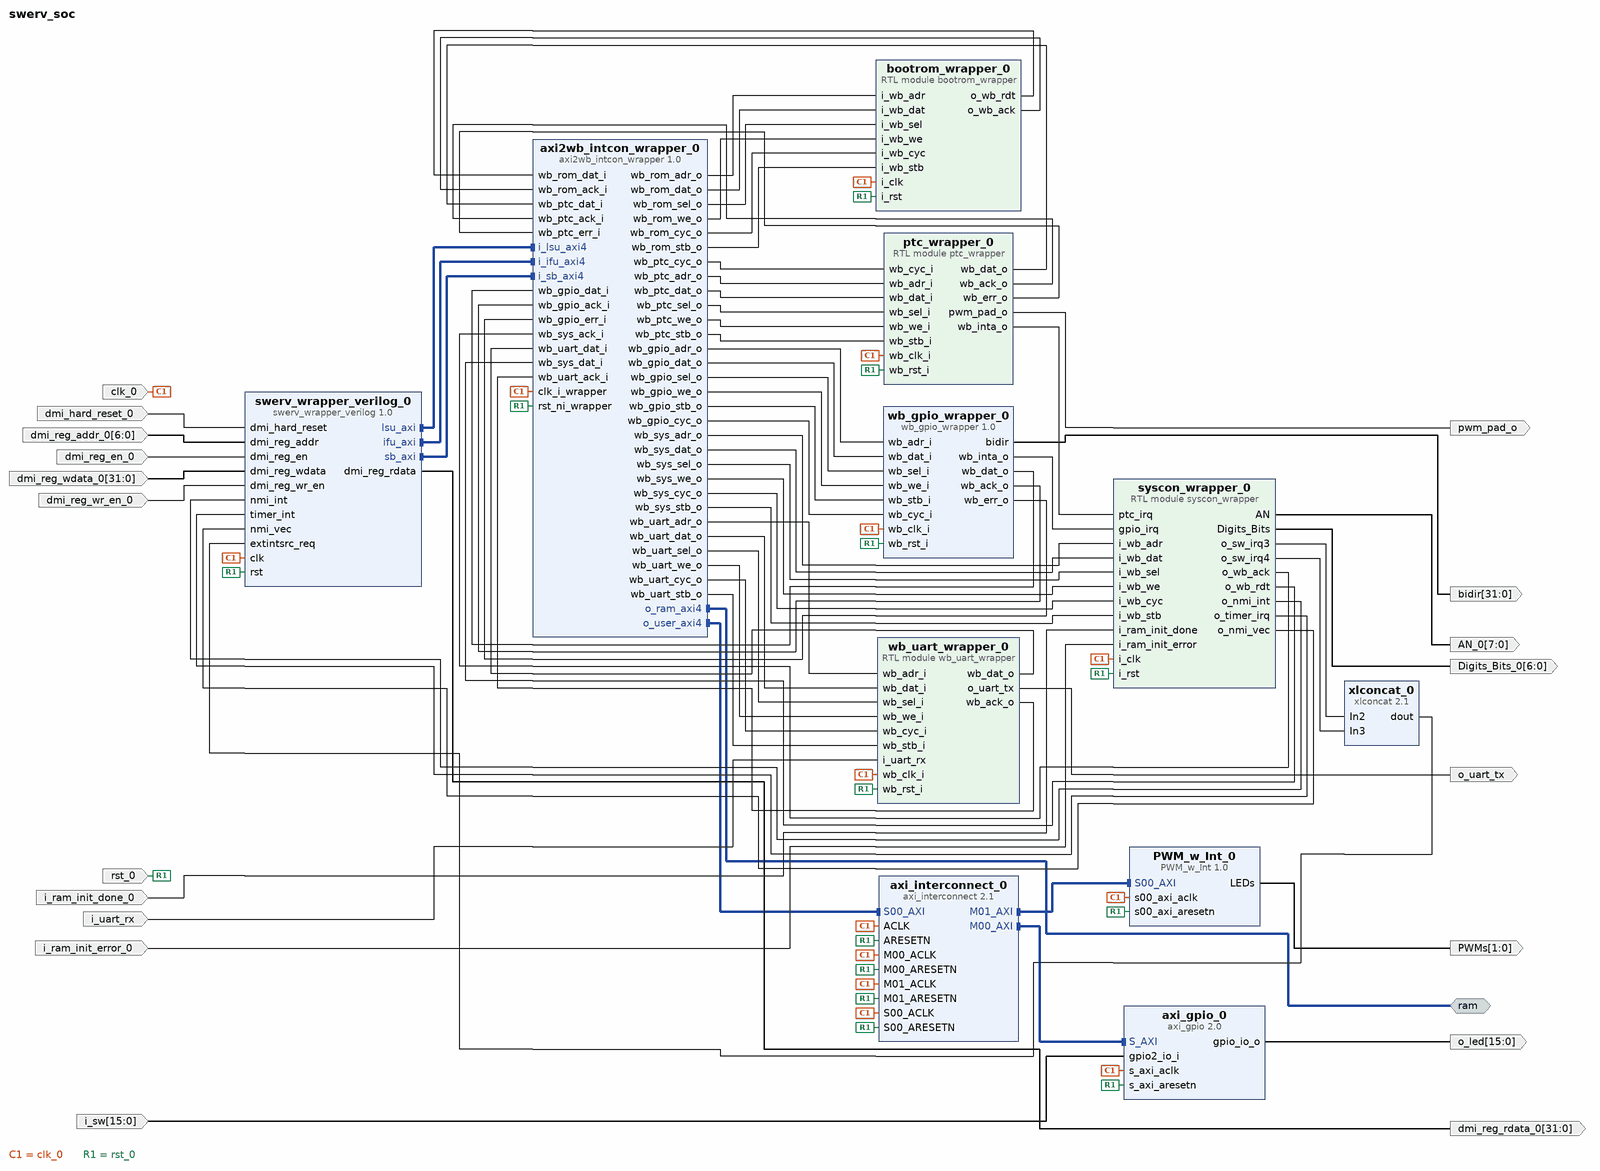
[diagram p0: block diagram of the top level]
# Vivado block design swerv_soc, xc7a100tcsg324-1, Vivado 2019.2
create_bd_design swerv_soc

create_bd_intf_port -mode Master -vlnv xilinx.com:interface:aximm_rtl:1.0 ram
set_property -dict {CONFIG.DATA_WIDTH 64 CONFIG.PROTOCOL AXI4 CONFIG.ADDR_WIDTH 32} [get_bd_intf_ports ram]
create_bd_port -dir I -type clk clk_0
create_bd_port -dir I -type rst dmi_hard_reset_0
create_bd_port -dir I -from 6 -to 0 dmi_reg_addr_0
create_bd_port -dir I dmi_reg_en_0
create_bd_port -dir O -from 31 -to 0 dmi_reg_rdata_0
create_bd_port -dir I -from 31 -to 0 dmi_reg_wdata_0
create_bd_port -dir I dmi_reg_wr_en_0
create_bd_port -dir I -type rst rst_0
create_bd_port -dir O -from 7 -to 0 AN_0
create_bd_port -dir O -from 6 -to 0 Digits_Bits_0
create_bd_port -dir I i_ram_init_done_0
create_bd_port -dir I i_ram_init_error_0
create_bd_port -dir O -from 31 -to 0 bidir
create_bd_port -dir O -from 15 -to 0 o_led
create_bd_port -dir I -from 15 -to 0 i_sw
create_bd_port -dir O o_uart_tx
create_bd_port -dir I i_uart_rx
create_bd_port -dir O -from 1 -to 0 PWMs
create_bd_port -dir O pwm_pad_o

create_bd_cell -type ip -vlnv xilinx.com:user:axi2wb_intcon_wrapper:1.0 axi2wb_intcon_wrapper_0
create_bd_cell -type ip -vlnv xilinx.com:user:wb_gpio_wrapper:1.0 wb_gpio_wrapper_0
create_bd_cell -type ip -vlnv xilinx.com:user:swerv_wrapper_verilog:1.0 swerv_wrapper_verilog_0
create_bd_cell -type module -reference bootrom_wrapper bootrom_wrapper_0
create_bd_cell -type ip -vlnv xilinx.com:ip:axi_interconnect:2.1 axi_interconnect_0
set_property -dict {CONFIG.NUM_MI 2} [get_bd_cells axi_interconnect_0]
create_bd_cell -type ip -vlnv xilinx.com:ip:axi_gpio:2.0 axi_gpio_0
set_property -dict [list \
  CONFIG.C_ALL_INPUTS_2 1 \
  CONFIG.C_ALL_OUTPUTS 1 \
  CONFIG.C_GPIO2_WIDTH 16 \
  CONFIG.C_GPIO_WIDTH 16 \
  CONFIG.C_IS_DUAL 1 \
] [get_bd_cells axi_gpio_0]
create_bd_cell -type module -reference wb_uart_wrapper wb_uart_wrapper_0
create_bd_cell -type ip -vlnv xilinx.com:user:PWM_w_Int:1.0 PWM_w_Int_0
create_bd_cell -type module -reference syscon_wrapper syscon_wrapper_0
create_bd_cell -type ip -vlnv xilinx.com:ip:xlconcat:2.1 xlconcat_0
set_property -dict {CONFIG.NUM_PORTS 8} [get_bd_cells xlconcat_0]
create_bd_cell -type module -reference ptc_wrapper ptc_wrapper_0

# ---- connections ----

connect_bd_intf_net [get_bd_intf_ports ram] [get_bd_intf_pins axi2wb_intcon_wrapper_0/o_ram_axi4]
connect_bd_intf_net [get_bd_intf_pins swerv_wrapper_verilog_0/lsu_axi] [get_bd_intf_pins axi2wb_intcon_wrapper_0/i_lsu_axi4]
connect_bd_intf_net [get_bd_intf_pins axi_interconnect_0/S00_AXI] [get_bd_intf_pins axi2wb_intcon_wrapper_0/o_user_axi4]
connect_bd_intf_net [get_bd_intf_pins axi_interconnect_0/M01_AXI] [get_bd_intf_pins PWM_w_Int_0/S00_AXI]
connect_bd_intf_net [get_bd_intf_pins swerv_wrapper_verilog_0/ifu_axi] [get_bd_intf_pins axi2wb_intcon_wrapper_0/i_ifu_axi4]
connect_bd_intf_net [get_bd_intf_pins swerv_wrapper_verilog_0/sb_axi] [get_bd_intf_pins axi2wb_intcon_wrapper_0/i_sb_axi4]
connect_bd_intf_net [get_bd_intf_pins axi_gpio_0/S_AXI] [get_bd_intf_pins axi_interconnect_0/M00_AXI]
connect_bd_net [get_bd_pins axi2wb_intcon_wrapper_0/wb_rom_adr_o] [get_bd_pins bootrom_wrapper_0/i_wb_adr]
connect_bd_net [get_bd_pins axi2wb_intcon_wrapper_0/wb_rom_dat_o] [get_bd_pins bootrom_wrapper_0/i_wb_dat]
connect_bd_net [get_bd_pins axi2wb_intcon_wrapper_0/wb_rom_sel_o] [get_bd_pins bootrom_wrapper_0/i_wb_sel]
connect_bd_net [get_bd_pins axi2wb_intcon_wrapper_0/wb_rom_we_o] [get_bd_pins bootrom_wrapper_0/i_wb_we]
connect_bd_net [get_bd_pins axi2wb_intcon_wrapper_0/wb_rom_cyc_o] [get_bd_pins bootrom_wrapper_0/i_wb_cyc]
connect_bd_net [get_bd_pins axi2wb_intcon_wrapper_0/wb_rom_stb_o] [get_bd_pins bootrom_wrapper_0/i_wb_stb]
connect_bd_net [get_bd_pins bootrom_wrapper_0/o_wb_rdt] [get_bd_pins axi2wb_intcon_wrapper_0/wb_rom_dat_i]
connect_bd_net [get_bd_pins bootrom_wrapper_0/o_wb_ack] [get_bd_pins axi2wb_intcon_wrapper_0/wb_rom_ack_i]
connect_bd_net [get_bd_pins axi2wb_intcon_wrapper_0/wb_sys_adr_o] [get_bd_pins syscon_wrapper_0/i_wb_adr]
connect_bd_net [get_bd_pins axi2wb_intcon_wrapper_0/wb_sys_dat_o] [get_bd_pins syscon_wrapper_0/i_wb_dat]
connect_bd_net [get_bd_pins axi2wb_intcon_wrapper_0/wb_sys_sel_o] [get_bd_pins syscon_wrapper_0/i_wb_sel]
connect_bd_net [get_bd_pins axi2wb_intcon_wrapper_0/wb_sys_we_o] [get_bd_pins syscon_wrapper_0/i_wb_we]
connect_bd_net [get_bd_pins axi2wb_intcon_wrapper_0/wb_sys_cyc_o] [get_bd_pins syscon_wrapper_0/i_wb_cyc]
connect_bd_net [get_bd_pins axi2wb_intcon_wrapper_0/wb_sys_stb_o] [get_bd_pins syscon_wrapper_0/i_wb_stb]
connect_bd_net [get_bd_pins syscon_wrapper_0/o_wb_ack] [get_bd_pins axi2wb_intcon_wrapper_0/wb_sys_ack_i]
connect_bd_net [get_bd_pins syscon_wrapper_0/o_wb_rdt] [get_bd_pins axi2wb_intcon_wrapper_0/wb_sys_dat_i]
connect_bd_net [get_bd_pins syscon_wrapper_0/o_nmi_int] [get_bd_pins swerv_wrapper_verilog_0/nmi_int]
connect_bd_net [get_bd_pins syscon_wrapper_0/o_timer_irq] [get_bd_pins swerv_wrapper_verilog_0/timer_int]
connect_bd_net [get_bd_pins syscon_wrapper_0/o_nmi_vec] [get_bd_pins swerv_wrapper_verilog_0/nmi_vec]
connect_bd_net [get_bd_pins axi2wb_intcon_wrapper_0/wb_gpio_adr_o] [get_bd_pins wb_gpio_wrapper_0/wb_adr_i]
connect_bd_net [get_bd_pins axi2wb_intcon_wrapper_0/wb_gpio_dat_o] [get_bd_pins wb_gpio_wrapper_0/wb_dat_i]
connect_bd_net [get_bd_pins axi2wb_intcon_wrapper_0/wb_gpio_sel_o] [get_bd_pins wb_gpio_wrapper_0/wb_sel_i]
connect_bd_net [get_bd_pins axi2wb_intcon_wrapper_0/wb_gpio_we_o] [get_bd_pins wb_gpio_wrapper_0/wb_we_i]
connect_bd_net [get_bd_pins axi2wb_intcon_wrapper_0/wb_gpio_stb_o] [get_bd_pins wb_gpio_wrapper_0/wb_stb_i]
connect_bd_net [get_bd_pins axi2wb_intcon_wrapper_0/wb_gpio_cyc_o] [get_bd_pins wb_gpio_wrapper_0/wb_cyc_i]
connect_bd_net [get_bd_pins wb_gpio_wrapper_0/wb_dat_o] [get_bd_pins axi2wb_intcon_wrapper_0/wb_gpio_dat_i]
connect_bd_net [get_bd_pins wb_gpio_wrapper_0/wb_ack_o] [get_bd_pins axi2wb_intcon_wrapper_0/wb_gpio_ack_i]
connect_bd_net [get_bd_pins wb_gpio_wrapper_0/wb_err_o] [get_bd_pins axi2wb_intcon_wrapper_0/wb_gpio_err_i]
connect_bd_net [get_bd_pins wb_gpio_wrapper_0/wb_inta_o] [get_bd_pins syscon_wrapper_0/gpio_irq]
connect_bd_net -net clk_0_1 [get_bd_ports clk_0] \
  [get_bd_pins swerv_wrapper_verilog_0/clk] [get_bd_pins axi2wb_intcon_wrapper_0/clk_i_wrapper] \
  [get_bd_pins bootrom_wrapper_0/i_clk] [get_bd_pins wb_gpio_wrapper_0/wb_clk_i] [get_bd_pins axi_interconnect_0/ACLK] \
  [get_bd_pins axi_gpio_0/s_axi_aclk] [get_bd_pins axi_interconnect_0/S00_ACLK] [get_bd_pins axi_interconnect_0/M00_ACLK] \
  [get_bd_pins wb_uart_wrapper_0/wb_clk_i] [get_bd_pins axi_interconnect_0/M01_ACLK] [get_bd_pins PWM_w_Int_0/s00_axi_aclk] \
  [get_bd_pins syscon_wrapper_0/i_clk] [get_bd_pins ptc_wrapper_0/wb_clk_i]
connect_bd_net -net dmi_hard_reset_0_1 [get_bd_ports dmi_hard_reset_0] [get_bd_pins swerv_wrapper_verilog_0/dmi_hard_reset]
connect_bd_net -net dmi_reg_addr_0_1 [get_bd_ports dmi_reg_addr_0] [get_bd_pins swerv_wrapper_verilog_0/dmi_reg_addr]
connect_bd_net -net dmi_reg_en_0_1 [get_bd_ports dmi_reg_en_0] [get_bd_pins swerv_wrapper_verilog_0/dmi_reg_en]
connect_bd_net [get_bd_pins swerv_wrapper_verilog_0/dmi_reg_rdata] [get_bd_ports dmi_reg_rdata_0]
connect_bd_net -net dmi_reg_wdata_0_1 [get_bd_ports dmi_reg_wdata_0] [get_bd_pins swerv_wrapper_verilog_0/dmi_reg_wdata]
connect_bd_net -net dmi_reg_wr_en_0_1 [get_bd_ports dmi_reg_wr_en_0] [get_bd_pins swerv_wrapper_verilog_0/dmi_reg_wr_en]
connect_bd_net -net rst_0_1 [get_bd_ports rst_0] \
  [get_bd_pins swerv_wrapper_verilog_0/rst] [get_bd_pins axi2wb_intcon_wrapper_0/rst_ni_wrapper] \
  [get_bd_pins bootrom_wrapper_0/i_rst] [get_bd_pins wb_gpio_wrapper_0/wb_rst_i] [get_bd_pins axi_interconnect_0/ARESETN] \
  [get_bd_pins axi_interconnect_0/S00_ARESETN] [get_bd_pins axi_interconnect_0/M00_ARESETN] \
  [get_bd_pins axi_gpio_0/s_axi_aresetn] [get_bd_pins wb_uart_wrapper_0/wb_rst_i] \
  [get_bd_pins axi_interconnect_0/M01_ARESETN] [get_bd_pins PWM_w_Int_0/s00_axi_aresetn] [get_bd_pins syscon_wrapper_0/i_rst] \
  [get_bd_pins ptc_wrapper_0/wb_rst_i]
connect_bd_net -net i_ram_init_done_0_1 [get_bd_ports i_ram_init_done_0] [get_bd_pins syscon_wrapper_0/i_ram_init_done]
connect_bd_net -net i_ram_init_error_0_1 [get_bd_ports i_ram_init_error_0] [get_bd_pins syscon_wrapper_0/i_ram_init_error]
connect_bd_net [get_bd_pins wb_gpio_wrapper_0/bidir] [get_bd_ports bidir]
connect_bd_net [get_bd_pins axi_gpio_0/gpio_io_o] [get_bd_ports o_led]
connect_bd_net -net gpio2_io_i_0_1 [get_bd_ports i_sw] [get_bd_pins axi_gpio_0/gpio2_io_i]
connect_bd_net [get_bd_pins axi2wb_intcon_wrapper_0/wb_uart_adr_o] [get_bd_pins wb_uart_wrapper_0/wb_adr_i]
connect_bd_net [get_bd_pins axi2wb_intcon_wrapper_0/wb_uart_dat_o] [get_bd_pins wb_uart_wrapper_0/wb_dat_i]
connect_bd_net [get_bd_pins axi2wb_intcon_wrapper_0/wb_uart_sel_o] [get_bd_pins wb_uart_wrapper_0/wb_sel_i]
connect_bd_net [get_bd_pins axi2wb_intcon_wrapper_0/wb_uart_we_o] [get_bd_pins wb_uart_wrapper_0/wb_we_i]
connect_bd_net [get_bd_pins axi2wb_intcon_wrapper_0/wb_uart_cyc_o] [get_bd_pins wb_uart_wrapper_0/wb_cyc_i]
connect_bd_net [get_bd_pins axi2wb_intcon_wrapper_0/wb_uart_stb_o] [get_bd_pins wb_uart_wrapper_0/wb_stb_i]
connect_bd_net [get_bd_pins wb_uart_wrapper_0/wb_dat_o] [get_bd_pins axi2wb_intcon_wrapper_0/wb_uart_dat_i]
connect_bd_net [get_bd_pins wb_uart_wrapper_0/wb_ack_o] [get_bd_pins axi2wb_intcon_wrapper_0/wb_uart_ack_i]
connect_bd_net [get_bd_pins wb_uart_wrapper_0/o_uart_tx] [get_bd_ports o_uart_tx]
connect_bd_net -net i_uart_rx_0_1 [get_bd_ports i_uart_rx] [get_bd_pins wb_uart_wrapper_0/i_uart_rx]
connect_bd_net [get_bd_pins PWM_w_Int_0/LEDs] [get_bd_ports PWMs]
connect_bd_net [get_bd_pins axi2wb_intcon_wrapper_0/wb_ptc_cyc_o] [get_bd_pins ptc_wrapper_0/wb_cyc_i]
connect_bd_net [get_bd_pins axi2wb_intcon_wrapper_0/wb_ptc_adr_o] [get_bd_pins ptc_wrapper_0/wb_adr_i]
connect_bd_net [get_bd_pins axi2wb_intcon_wrapper_0/wb_ptc_dat_o] [get_bd_pins ptc_wrapper_0/wb_dat_i]
connect_bd_net [get_bd_pins axi2wb_intcon_wrapper_0/wb_ptc_sel_o] [get_bd_pins ptc_wrapper_0/wb_sel_i]
connect_bd_net [get_bd_pins axi2wb_intcon_wrapper_0/wb_ptc_we_o] [get_bd_pins ptc_wrapper_0/wb_we_i]
connect_bd_net [get_bd_pins axi2wb_intcon_wrapper_0/wb_ptc_stb_o] [get_bd_pins ptc_wrapper_0/wb_stb_i]
connect_bd_net [get_bd_pins ptc_wrapper_0/wb_dat_o] [get_bd_pins axi2wb_intcon_wrapper_0/wb_ptc_dat_i]
connect_bd_net [get_bd_pins ptc_wrapper_0/wb_ack_o] [get_bd_pins axi2wb_intcon_wrapper_0/wb_ptc_ack_i]
connect_bd_net [get_bd_pins ptc_wrapper_0/wb_err_o] [get_bd_pins axi2wb_intcon_wrapper_0/wb_ptc_err_i]
connect_bd_net [get_bd_pins ptc_wrapper_0/wb_inta_o] [get_bd_pins syscon_wrapper_0/ptc_irq]
connect_bd_net [get_bd_pins xlconcat_0/dout] [get_bd_pins swerv_wrapper_verilog_0/extintsrc_req]
connect_bd_net [get_bd_pins syscon_wrapper_0/o_sw_irq3] [get_bd_pins xlconcat_0/In2]
connect_bd_net [get_bd_pins syscon_wrapper_0/o_sw_irq4] [get_bd_pins xlconcat_0/In3]
connect_bd_net [get_bd_pins syscon_wrapper_0/AN] [get_bd_ports AN_0]
connect_bd_net [get_bd_pins syscon_wrapper_0/Digits_Bits] [get_bd_ports Digits_Bits_0]
connect_bd_net [get_bd_pins ptc_wrapper_0/pwm_pad_o] [get_bd_ports pwm_pad_o]

# ---- address map ----
assign_bd_address -offset 0x00000000 -range 128M -target_address_space [get_bd_addr_spaces axi2wb_intcon_wrapper_0/o_ram_axi4] [get_bd_addr_segs ram/Reg]
assign_bd_address -offset 0x80100000 -range 64K -target_address_space [get_bd_addr_spaces axi2wb_intcon_wrapper_0/o_user_axi4] [get_bd_addr_segs axi_gpio_0/S_AXI/Reg]
assign_bd_address -offset 0x80120000 -range 64K -target_address_space [get_bd_addr_spaces axi2wb_intcon_wrapper_0/o_user_axi4] [get_bd_addr_segs PWM_w_Int_0/S00_AXI/S00_AXI_reg]
assign_bd_address -offset 0x00000000 -range 4G -target_address_space [get_bd_addr_spaces swerv_wrapper_verilog_0/ifu_axi] [get_bd_addr_segs axi2wb_intcon_wrapper_0/i_ifu_axi4/reg0]
assign_bd_address -offset 0x00000000 -range 4G -target_address_space [get_bd_addr_spaces swerv_wrapper_verilog_0/lsu_axi] [get_bd_addr_segs axi2wb_intcon_wrapper_0/i_lsu_axi4/reg0]
assign_bd_address -offset 0x00000000 -range 4G -target_address_space [get_bd_addr_spaces swerv_wrapper_verilog_0/sb_axi] [get_bd_addr_segs axi2wb_intcon_wrapper_0/i_sb_axi4/reg0]

validate_bd_design
save_bd_design
